# Altium schematic sheet 1_AS5600.schdoc.schdoc
size 431 x 309 mm; Symbol: Sheet-Symbol_A3; Device: Sheet-Symbol_A3; Company: 嘉立创EDA; Version: V1.0; Page Size: A3; @Project Name: 基于AT32F413 的FOC驱动器; @Page Count: 1; @Update Date: 2024-04-27; @Create Date: 2023-11-18; @Schematic Name: AS5600; @Page No: 1; @Page Name: AS5600
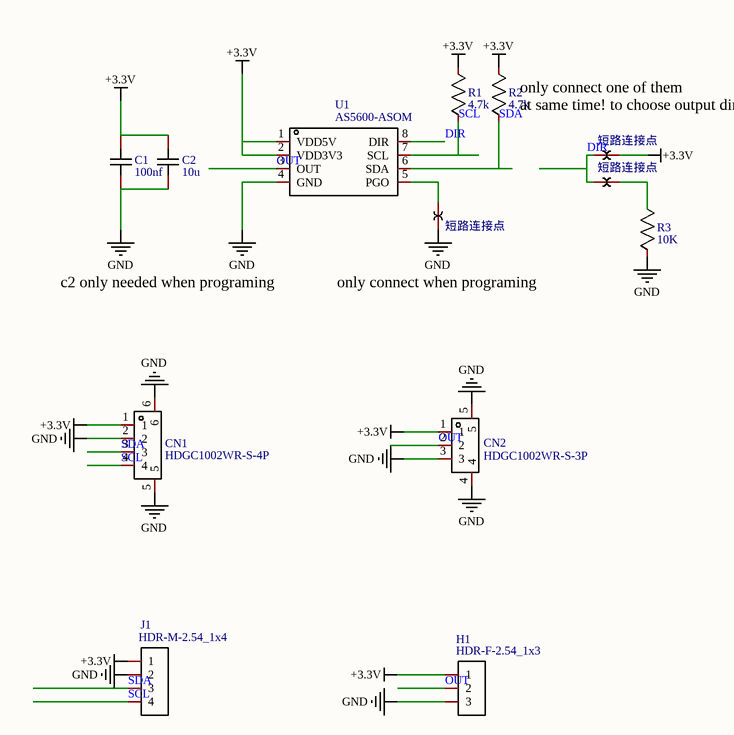
[diagram p0: 1_AS5600.schdoc.schdoc]

## Parts
C1  100nf  [C0603]
C2  10u  [C0603]
CN1  HDGC1002WR-S-4P  [CONN-SMD_4P-P1.00_HDGC_HDGC1002WR-S-4P]
CN2  HDGC1002WR-S-3P  [CONN-SMD_3P-P1.00_HDGC_HDGC1002WR-S-3P]
H1  HDR-F-2.54_1x3  [HDR-F-2.54_1X3]
J1  HDR-M-2.54_1x4  [HDR-M-2.54_1X4]
NO1  短路连接点  [短路连接点]
NO2  短路连接点  [短路连接点]
NO3  短路连接点  [短路连接点]
R1  4.7k  [R0603]
R2  4.7k  [R0603]
R3  10K  [R0603]
U1  AS5600-ASOM  [SOIC-8_L5.0-W4.0-P1.27-LS6.0-BL]

## Nets
+3.3V: C1.2 C2.2 CN1.1 CN2.1 H1.1 J1.1 NO3.1 R1.2 R2.2 U1.1(VDD5V) U1.2(VDD3V3)
GND: C1.1 C2.1 CN1.2 CN1.5 CN1.6 CN2.3 CN2.4 CN2.5 H1.3 J1.2 NO1.2 R3.1 U1.4(GND)
DIR: NO2.2 NO3.2 U1.8(DIR)
OUT: CN2.2 H1.2 U1.3(OUT)
SCL: CN1.4 J1.4 R1.1 U1.7(SCL)
SDA: CN1.3 J1.3 R2.1 U1.6(SDA)
NetNO1_1: NO1.1 U1.5(PGO)
NetNO2_1: NO2.1 R3.2

## Notes on the sheet
- only connect one of them
  at same time! to choose output direction
- c2 only needed when programing
- only connect when programing
- 1
- 2
- 3
- 4
- 5
- 6
- A
- B
- C
- 原理图
- AS5600
- 创建日期
- 更新日期
- 2024-04-27
- 2023-11-18
- D
- 审阅
- 绘制
- 图页
- 物料编码
- 基于AT32F413 的FOC驱动器
- 版本
- 尺寸
- 页
- 共
- V1.0
- A3
- 嘉立创EDA

## Library data of the parts
C1 = 100nf: Convert to PCB: yes; Name: 100nf; Symbol: 100nf; Device: 100nf; Add into BOM: yes; Origin Footprint: C0603
C2 = 10u: Convert to PCB: yes; Name: 10u; Symbol: 10u; Device: 10u; Add into BOM: yes; Origin Footprint: C0603
CN1 = HDGC1002WR-S-4P: Manufacturer: HDGC(华德共创); Convert to PCB: yes; Name: HDGC1002WR-S-4P; Symbol: HDGC1002WR-S-4P; Device: HDGC1002WR-S-4P; Supplier: LCSC; Supplier Part: C2936214; Manufacturer Part: HDGC1002WR-S-4P; JLCPCB Part Class: Extended Part; Add into BOM: yes; Origin Footprint: CONN-SMD_4P-P1.00_HDGC_HDGC1002WR-S-4P
CN2 = HDGC1002WR-S-3P: Manufacturer: HDGC(华德共创); Convert to PCB: yes; Name: HDGC1002WR-S-3P; Symbol: HDGC1002WR-S-3P; Device: HDGC1002WR-S-3P; Supplier: LCSC; Supplier Part: C2936213; Manufacturer Part: HDGC1002WR-S-3P; Add into BOM: yes; Origin Footprint: CONN-SMD_3P-P1.00_HDGC_HDGC1002WR-S-3P
H1 = HDR-F-2.54_1x3: Convert to PCB: yes; Name: HDR-F-2.54_1x3; Symbol: HDR-F-2.54_1x3; Device: HDR-F-2.54_1x3; Supplier Part: C146690; Supplier: LCSC; Add into BOM: yes; Origin Footprint: HDR-F-2.54_1X3
J1 = HDR-M-2.54_1x4: Convert to PCB: yes; Name: HDR-M-2.54_1x4; Symbol: HDR-M-2.54_1x4; Device: HDR-M-2.54_1x4; Supplier Part: C124378; Supplier: LCSC; Add into BOM: yes; Origin Footprint: HDR-M-2.54_1X4
NO1-NO3 = 短路连接点: Convert to PCB: yes; Name: 短路连接点; Symbol: 短路连接点; Device: 短路连接点; Supplier: MONIK2020; Add into BOM: yes; Origin Footprint: 短路连接点
R1 R2 = 4.7k: Convert to PCB: yes; Name: 4.7k; Symbol: 4.7k; Device: 4.7k; Add into BOM: yes; Origin Footprint: R0603
R3 = 10K: Convert to PCB: yes; Name: 10K; Symbol: 10K; Device: 10K; Add into BOM: yes; Origin Footprint: R0603
U1 = AS5600-ASOM: Manufacturer: Ams; Convert to PCB: yes; Name: AS5600-ASOM; Symbol: AS5600-ASOM; Device: AS5600-ASOM; Supplier: LCSC; Manufacturer Part: AS5600-ASOM; Supplier Part: C79815; JLCPCB Part Class: Extended Part; Add into BOM: yes; Origin Footprint: SOIC-8_L5.0-W4.0-P1.27-LS6.0-BL